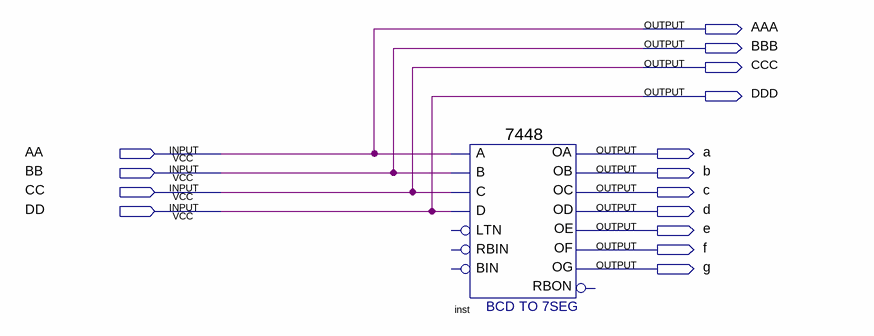
[diagram p0: schematic sheet]
// Quartus schematic SIGMENT.bdf as structural Verilog: 1 symbols, 15 pins
module SIGMENT (
  input  AA,
  input  BB,
  input  CC,
  input  DD,
  output AAA,
  output BBB,
  output CCC,
  output DDD,
  output a,
  output b,
  output c,
  output d,
  output e,
  output f,
  output g
);

  \7448  inst (
    .A(AA), .C(CC), .D(DD), .B(BB), .OC(c), .OE(e), .OD(d), .OF(f), .OG(g), .OB(b), .OA(a));  // open: RBIN, BIN, LTN, RBON

  assign AAA = AA;
  assign BBB = BB;
  assign CCC = CC;
  assign DDD = DD;
endmodule
